# Altium schematic sheet RF2401.SchDoc
size A3; SheetNumber: 7; SheetTotal: 17
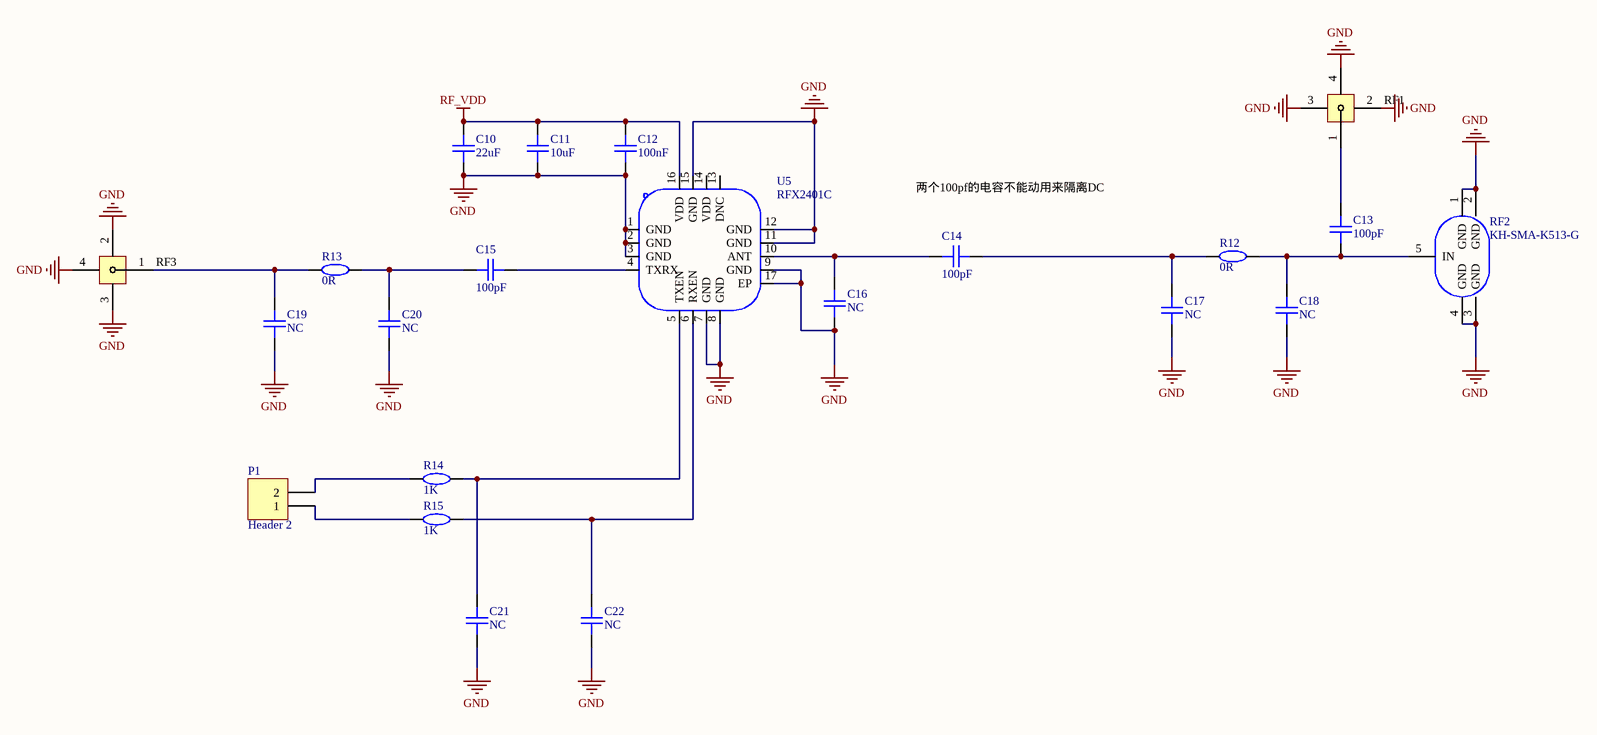
[diagram p0: RF2401.SchDoc]

## Parts
C10  22uF  [C0603]
C11  10uF  [C0603]
C12  100nF  [C0402]
C13  100pF  [C0402]
C14  100pF  [C0402]
C15  100pF  [C0402]
C16  NC  [C0402]
C17  NC  [C0402]
C18  NC  [C0402]
C19  NC  [C0402]
C20  NC  [C0402]
C21  NC  [C0402]
C22  NC  [C0402]
P1  Header 2  [HDR1X2]
R12  0R  [R0402]
R13  0R  [R0402]
R14  1K  [R0402]
R15  1K  [R0402]
RF1  BWIPX-4-001E  [IPEX-SMD_BWIPX-4-001E]  (value not drawn)
RF2  KH-SMA-K513-G  [ANT-TH_KH-SMA-K513-G]
RF3  BWIPX-4-001E  [IPEX-SMD_BWIPX-4-001E]  (value not drawn)
U5  RFX2401C  [QFN-16_L3.0-W3.0-P0.50-BL-EP1.7]

## Nets
GND: C10.1 C11.1 C12.1 C16.2 C17.2 C18.2 C19.2 C20.2 C21.2 C22.2 RF1.2 RF1.3 RF1.4 RF2.1(GND) RF2.2(GND) RF2.3(GND) RF2.4(GND) RF3.2 RF3.3 RF3.4 U5.1(GND) U5.2(GND) U5.3(GND) U5.7(GND) U5.8(GND) U5.9(GND) U5.11(GND) U5.12(GND) U5.15(GND) U5.17(EP)
RF_VDD: C10.2 C11.2 C12.2 U5.16(VDD)
NetC13_1: C13.1 RF1.1
NetC13_2: C13.2 C18.1 R12.2 RF2.5(IN)
NetC14_1: C14.1 C17.1 R12.1
NetC14_2: C14.2 C16.1 U5.10(ANT)
NetC15_1: C15.1 U5.4(TXRX)
NetC15_2: C15.2 C20.1 R13.2
NetC19_1: C19.1 R13.1 RF3.1
NetC21_1: C21.1 R14.2 U5.5(TXEN)
NetC22_1: C22.1 R15.2 U5.6(RXEN)
NetP1_1: P1.1 R15.1
NetP1_2: P1.2 R14.1

Not connected (* = marked no-connect by the designer): U5 13(DNC) 14(VDD)

## Notes on the sheet
- 两个100pf的电容不能动用来隔离DC

## Library data of the parts
C10 C11 = CAP_0603: Symbol: CapAcitance; Convert to PCB: yes; Device: CAP_0603; Add into BOM: yes; Supplier Footprint: 0603
  C10: Value: 22uF; Name: 22uF
  C11: Value: 10uF; Name: 10uF
C12-C22 = CAP_0402: Symbol: CapAcitance; Device: CAP_0603; Convert to PCB: yes; Add into BOM: yes; Supplier Footprint: 0603
  C12: Value: 100nF; Name: 100nF
  C13-C15: Value: 100pF; Name: 100pF
  C16-C22: Value: NC; Name: NC
P1 = Header 2: Header, 2-Pin; LatestRevisionDate: 17-Jul-2002; LatestRevisionNote: Re-released for DXP Platform.; Publisher: Altium Limited
R12-R15 = Res_0402: Symbol: 电阻; Device: Res_0603; Convert to PCB: yes; Add into BOM: yes; Supplier Footprint: 0603
  R12 R13: Value: 0R; Name: 0R
  R14 R15: Value: 1K; Name: 1K
RF1 RF3 = BWIPX-4-001E: C784401; Manufacturer: BAT WIRELESS(蝙蝠无线); Add into BOM: yes; Connector Type: 板端; Interface Type: 内针; Interface Diameter: 1.5mm; RF Series: IPEX; Number of Ports: 1; Name: BWIPX-4-001E; Symbol: BWIPX-4-001E; Device: BWIPX-4-001E; LCSC Part Name: IPEX 内针 四代板端 IPEX4座子; Supplier Part: C784401; Manufacturer Part: BWIPX-4-001E; Supplier Footprint: SMD; JLCPCB Part Class: Extended Part; Datasheet: https://atta.szlcsc.com/upload/public/pdf/source/20200915/C784401_F782AD355A18B33ABEEDBC6CC33688E9.pdf; Supplier: LCSC; Convert to PCB: yes; Frequency-Max: -; Impedance: -; Style: -; Interface Length/Height: -; Operating Temperature Range: -
RF2 = KH-SMA-K513-G: Manufacturer: kinghelm(金航标); Add into BOM: yes; Connector Type: 板端; Interface Type: 内孔; Number of Ports: 1; Frequency-Max: 6GHz; RF Series: SMA; Impedance: 50Ω; Style: 弯头; Symbol: KH-SMA-K513-G; Device: KH-SMA-K513-G; LCSC Part Name: SMA 内孔 弯头; Supplier Part: C411575; Manufacturer Part: KH-SMA-K513-G; Supplier Footprint: 插件; JLCPCB Part Class: 扩展库; Datasheet: https://atta.szlcsc.com/upload/public/pdf/source/20210317/C411575_49039CD64129040639EC5218E5A2C783.pdf; Supplier: LCSC; Convert to PCB: yes; Interface Diameter: -; Interface Length/Height: -; Operating Temperature Range: -55℃~+155℃; Name: KH-SMA-K513-G
U5 = RFX2401C: Manufacturer: SKYWORKS; Add into BOM: yes; Frequency Range: 2.4GHz~2.5GHz; Symbol: RFX2401C; Device: RFX2401C; LCSC Part Name: 2.4GHz ZIGBEE/ISM发送/接收射频前端集成电路; Supplier Part: C19213; Manufacturer Part: RFX2401C; Supplier Footprint: QFN-16-EP(3x3); JLCPCB Part Class: 扩展库; Datasheet: https://atta.szlcsc.com/upload/public/pdf/source/20130922/1457706649469.pdf; Supplier: LCSC; Convert to PCB: yes; Applications: 802.15.4,Zigbee; Name: RFX2401C